# EAGLE design Pressure_pump_V2.1 (EAGLE 9.6.2)
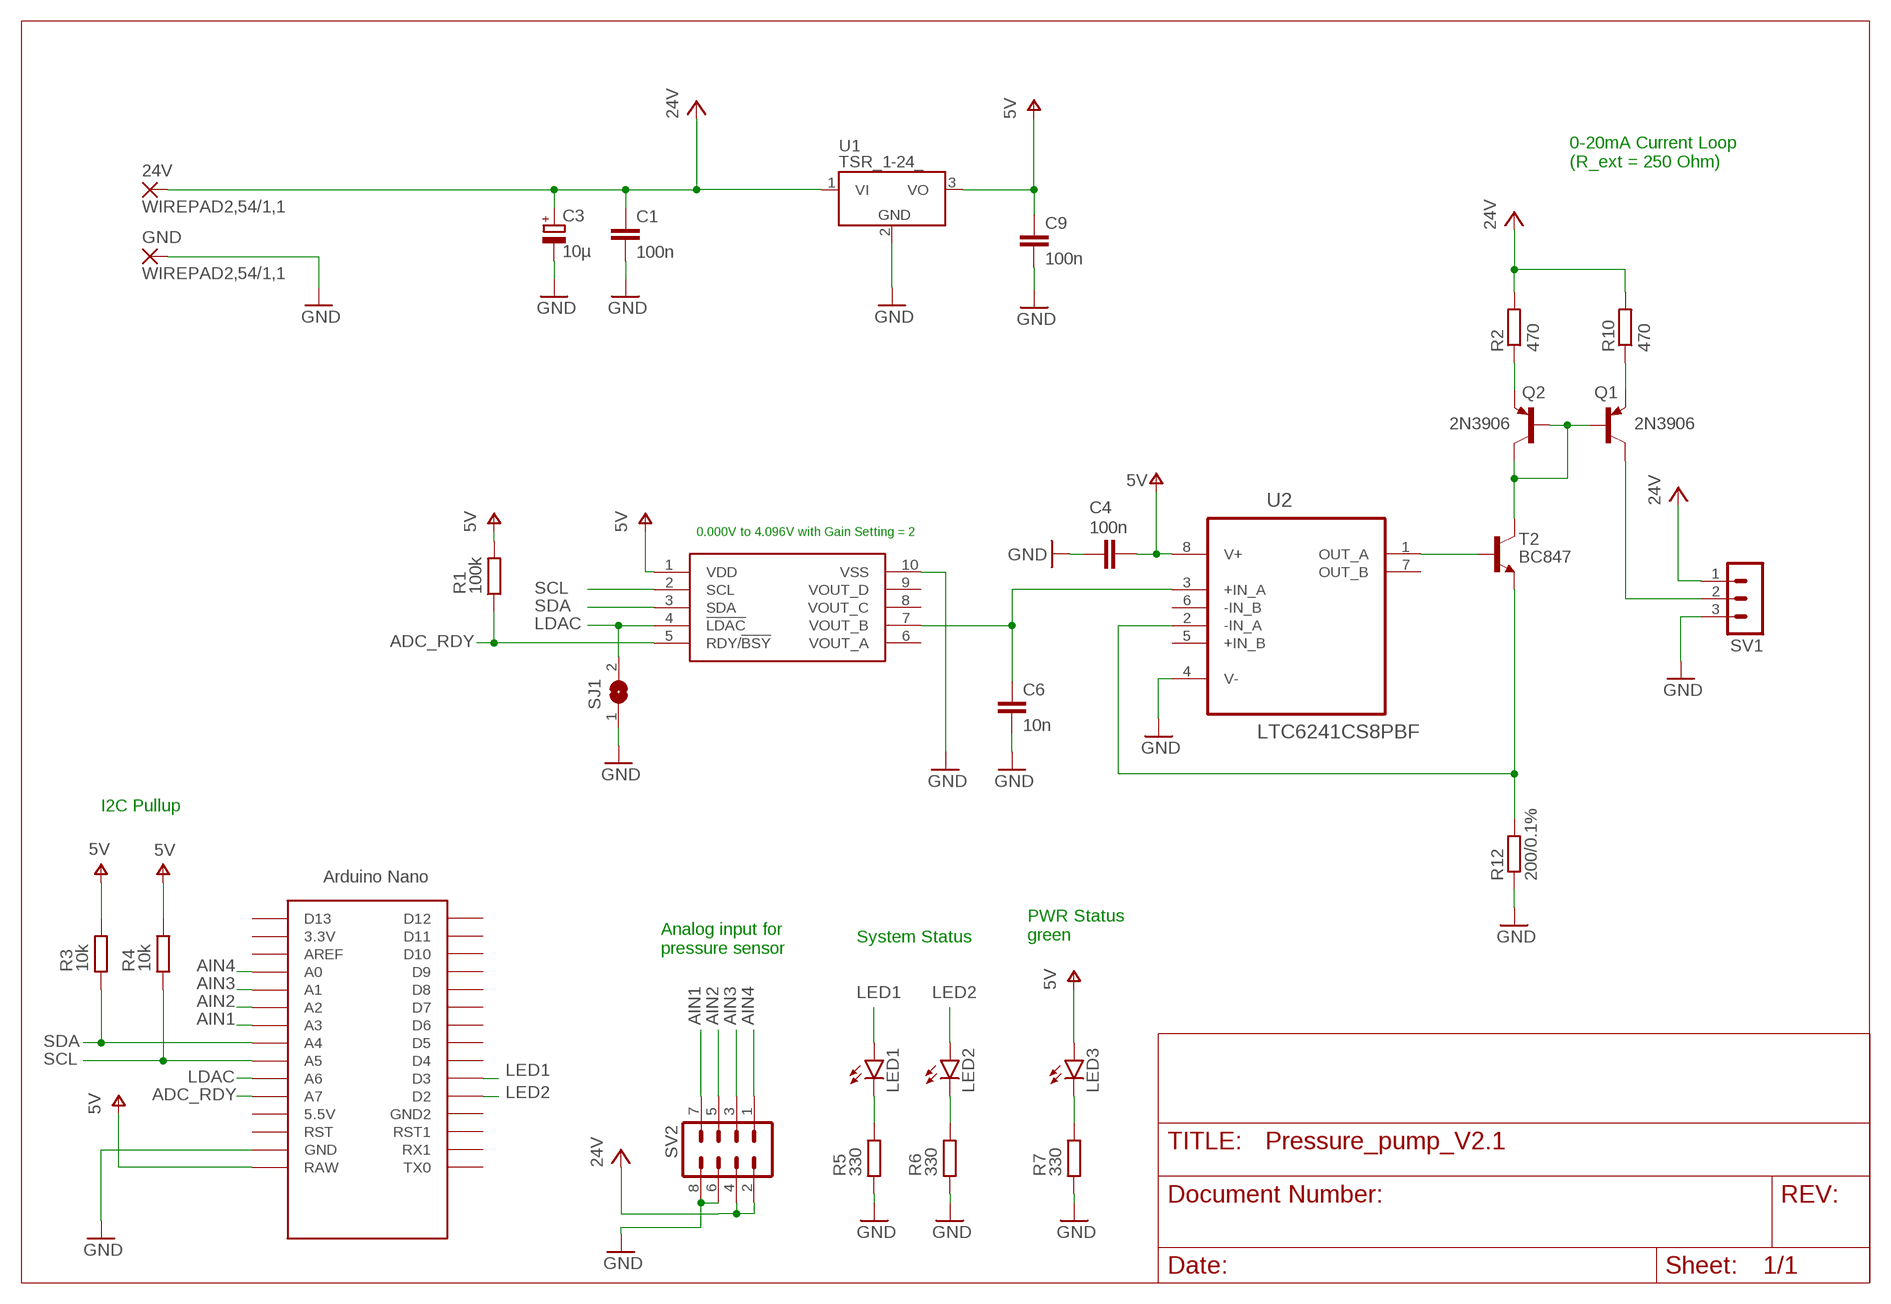
[diagram p0: schematic, sheet 1]

## Parts
24V  WIREPAD2,54/1,1  [2,54/1,1]
C1  100n  C-EUC0603  [C0603]
C3  10µ  CPOL-EU153CLV-0810  [153CLV-0810]
C4  100n  C-EUC0603  [C0603]
C6  10n  C-EUC0603  [C0603]
C9  100n  C-EUC0603  [C0603]
GND  WIREPAD2,54/1,1  [2,54/1,1]
LED1  LED5MM  [LED5MM]
LED2  LED5MM  [LED5MM]
LED3  LED5MM  [LED5MM]
Q1  2N3906  [TO92]
Q2  2N3906  [TO92]
R1  100k  R-EU_R0603  [R0603]
R2  470  R-EU_R0603  [R0603]
R3  10k  R-EU_R0603  [R0603]
R4  10k  R-EU_R0603  [R0603]
R5  330  R-EU_R0603  [R0603]
R6  330  R-EU_R0603  [R0603]
R7  330  R-EU_R0603  [R0603]
R10  470  R-EU_R0603  [R0603]
R12  200/0.1%  R-EU_R0805  [R0805]
SJ1  SJ  [SJ]
SV1  MA03-1  [MA03-1]
SV2  MA04-2  [MA04-2]
T2  BC847  [SOT23]
U1  TSR_1-24_  [TSR-1]
U2  LTC6241CS8PBF  [SOIC127P600X175-8N]
U$1  NANO  [NANO]
U$2  MCP4728  [MSOP10]

## Nets
24V: 24V.1(P) C1.1 C3.+ R2.2 R10.2 SV1.1 SV2.2 SV2.4 U1.1(VI)
ADC_RDY: R1.1 U$1.A7 U$2.5(RDY/!BSY)
AIN1: SV2.7 U$1.A3
AIN2: SV2.5 U$1.A2
AIN3: SV2.3 U$1.A1
AIN4: SV2.1 U$1.A0
GND: C1.2 C3.- C4.1 C6.2 C9.2 GND.1(P) R5.1 R6.1 R7.1 R12.1 SJ1.1 SV1.3 SV2.6 SV2.8 U1.2(GND) U2.4(V-) U$1.GND U$2.10(VSS)
LDAC: SJ1.2 U$1.A6 U$2.4(!LDAC)
LED1: LED1.A U$1.D3
LED2: LED2.A U$1.D2
N$1: Q1.1(C) SV1.2
N$2: Q1.3(E) R10.1
N$3: Q1.2(B) Q2.1(C) Q2.2(B) T2.3(C)
N$4: Q2.3(E) R2.1
N$5: T2.1(B) U2.1(OUT_A)
N$8: LED1.K(C) R5.2
N$9: LED2.K(C) R6.2
N$10: LED3.K(C) R7.2
N$12: C6.1 U2.3(+IN_A) U$2.7(VOUT_B)
N$26: R12.2 T2.2(E) U2.2(-IN_A)
SCL: R4.1 U$1.A5 U$2.2(SCL)
SDA: R3.1 U$1.A4 U$2.3(SDA)
V+: C4.2 C9.1 LED3.A R1.2 R3.2 R4.2 U1.3(VO) U2.8(V+) U$1.RAW U$2.1(VDD) ; supply symbol labelled 5V
Unconnected: U2.5(+IN_B) U2.6(-IN_B) U2.7(OUT_B) U$1.3.3V U$1.5V(5.5V) U$1.AREF U$1.D4 U$1.D5 U$1.D6 U$1.D7 U$1.D8 U$1.D9 U$1.D10 U$1.D11 U$1.D12 U$1.D13 U$1.GND1(GND2) U$1.ICSP1 U$1.ICSP2 U$1.ICSP3 U$1.ICSP4 U$1.ICSP5 U$1.ICSP6 U$1.RST U$1.RST1 U$1.RX1 U$1.TX0 U$2.6(VOUT_A) U$2.8(VOUT_C) U$2.9(VOUT_D)

## Notes on the sheet
- 0-20mA Current Loop
  (R_ext = 250 Ohm)
- 0.000V to 4.096V with Gain Setting = 2
- I2C Pullup
- PWR Status
  green
- System Status
- Analog input for 
  pressure sensor

## Library data of the parts
24V GND = wirepad:WIREPAD: Wire PAD connect wire on PCB
C1 C4 C6 C9 = rcl:C-EU: CAPACITOR, European symbol; SPICEPREFIX: C
C3 = rcl:CPOL-EU: POLARIZED CAPACITOR, European symbol; SPICEPREFIX: C
LED1-LED3 = led:LED: LED OSRAM: - CHIPLED LG R971, LG N971, LY N971, LG Q971, LY Q971, LO R971, LY R971 LH N974, LH R974 LS Q976, LO Q976, LY Q976 LO Q996 - Hyper CHIPLED LW Q18S LB Q993, LB Q99A, LB R99A - SideLED LS A670, LO A670, LY A670, LG A670, LP A670 LB A673, LV A673, LT A673, LW A673 LH A674 LY A675 LS A676, LA A676, LO A676, LY A676, LW A676 LS A679, LY A679, LG A679 - Hyper Micro SIDELED® LS Y876, LA Y876, LO Y876, LY Y876 LT Y87S - SmartLED LW L88C, LW L88S LB L89C, LB L89S, LG L890 LS L89K, LO L89K, LY L89K LS L896, LA L896, LO L896, LY L896 - TOPLED LS T670, LO T670, LY T670, LG T670, LP T670 LSG T670, LSP T670, LSY T670, LOP T670, LYG T670 LG T671, LOG T671, LSG T671 LB T673, LV T673, LT T673, LW T673 LH T674 LS T676, LA T676, LO T676, LY T676, LB T676, LH T676, LSB T676, LW T676 LB T67C, LV T67C, LT T67C, LS T67K, LO T67K, LY T67K, LW E67C LS E67B, LA E67B, LO E67B, LY E67B, LB E67C, LV E67C, LT E67C LW T67C LS T679, LY T679, LG T679 LS T770, LO T770, LY T770, LG T770, LP T770 LB T773, LV T773, LT T773, LW T773 LH T774 LS E675, LA E675, LY E675, LS T675 LS T776, LA T776, LO T776, LY T776, LB T776 LHGB T686 LT T68C, LB T68C - Hyper Mini TOPLED® LB M676 - Mini TOPLED Santana® LG M470 LS M47K, LO M47K, LY M47K Source: http://www.osram.convergy.de LUXEON: - LUMILED® LXK2-PW12-R00, LXK2-PW12-S00, LXK2-PW14-U00, LXK2-PW14-V00 LXK2-PM12-R00, LXK2-PM12-S00, LXK2-PM14-U00 LXK2-PE12-Q00, LXK2-PE12-R00, LXK2-PE12-S00, LXK2-PE14-T00, LXK2-PE14-U00 LXK2-PB12-K00, LXK2-PB12-L00, LXK2-PB12-M00, LXK2-PB14-N00, LXK2-PB14-P00, LXK2-PB14-Q00 LXK2-PR12-L00, LXK2-PR12-M00, LXK2-PR14-Q00, LXK2-PR14-R00 LXK2-PD12-Q00, LXK2-PD12-R00, LXK2-PD12-S00 LXK2-PH12-R00, LXK2-PH12-S00 LXK2-PL12-P00, LXK2-PL12-Q00, LXK2-PL12-R00 Source: www.luxeon.com KINGBRIGHT: KA-3528ASYC Source: www.kingbright.com
Q1 Q2 = transistor-pnp:2N3906: PNP Transistor
R1-R7 R10 R12 = rcl:R-EU_: RESISTOR, European symbol; SPICEPREFIX: R
SJ1 = jumper:SJ: SMD solder JUMPER
SV1 = con-lstb:MA03-1: PIN HEADER; OC_FARNELL: unknown; OC_NEWARK: unknown
SV2 = con-lstb:MA04-2: PIN HEADER; OC_FARNELL: unknown; OC_NEWARK: unknown
T2 = transistor:BC847: NPN TRANSISTOR
U1 = _traco_tsr-1:TSR_1-*: TRACO TSR-1 Series Point-of-Load DC/DC-Converters Vi max. 36 V; Vo = (1.2 .. 15)V ±2%; Io = 0 .. 1 A SIP-Package (drop-in replacement for 78xx linear voltage regulators in TO220-package, vertically assembled) Source: www.tracopower.com Technologies: TSR 1- Vi (V) Vo (V) ±2% Io = 0 .. 1 A 24_ ( generic ) 2412 4.6 .. 36 1.2 2415 4.6 .. 36 1.5 2418 4.6 .. 36 1.8 2425 4.6 .. 36 2.5 2433 4.75.. 36 3.3 2450 6.5 .. 36 5.0 2465 9.0 .. 36 6.5 2490 12 .. 36 9.0 24120 15 .. 36 12 24150 18 .. 36 15 Author: Dipl.-Ing. FH Rainer Bayer HHN Hochschule Heilbronn, rainer.bayer@hs-heilbronn.de Ingenieurbüro ing-rb, mail@ing-rb.de
U2 = LTC_By_element14_Batch_1:LTC6241CS8PBF: Low Noise, Rail-to-Rail Output,CMOS Op Amps; MPN: LTC6241CS8#PBF; OC_FARNELL: 1330969; OC_NEWARK: 56M9989; PACKAGE: SOIC-8; SUPPLIER: Linear Technology
U$1 = Arduino-clone:NANO: Arduino Nano
U$2 = Eagle-Library:MCP4728

## Board
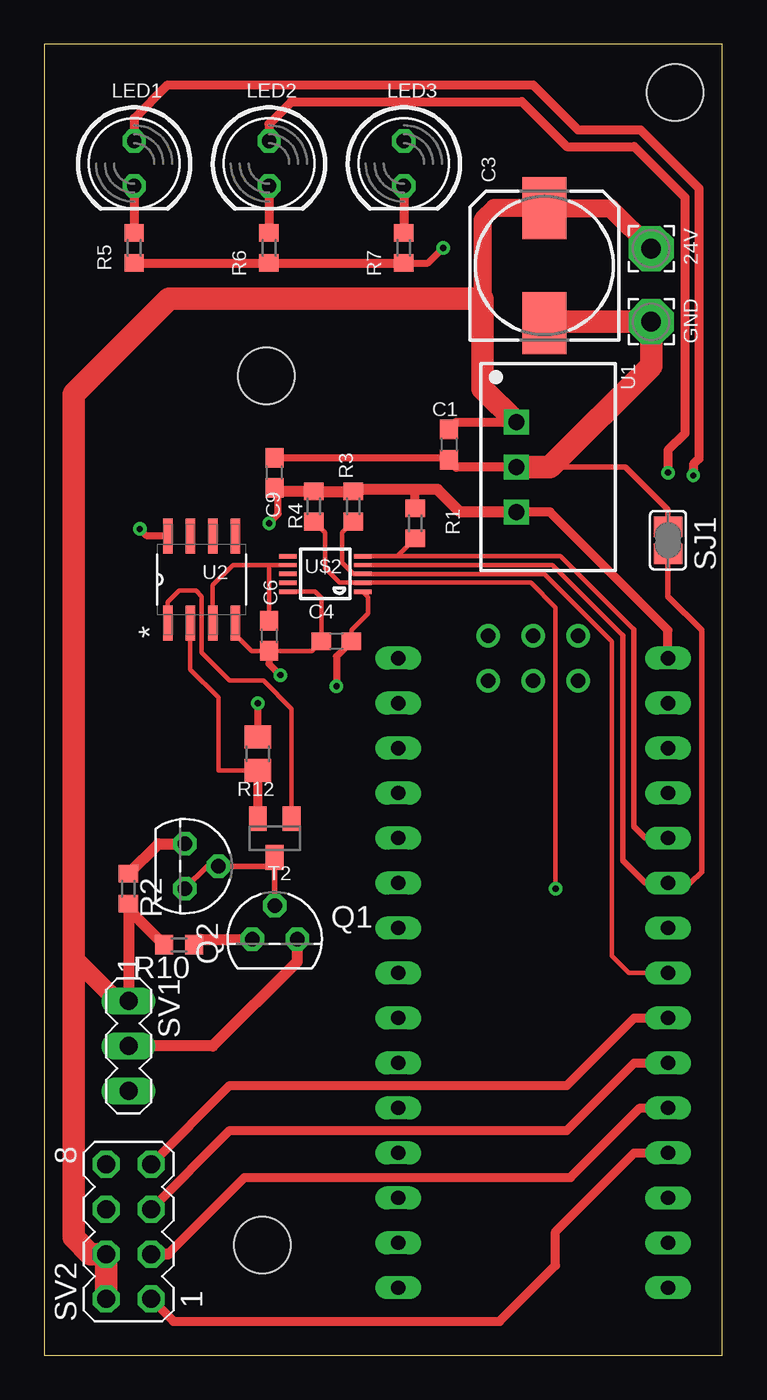
[diagram p1: board, top side]
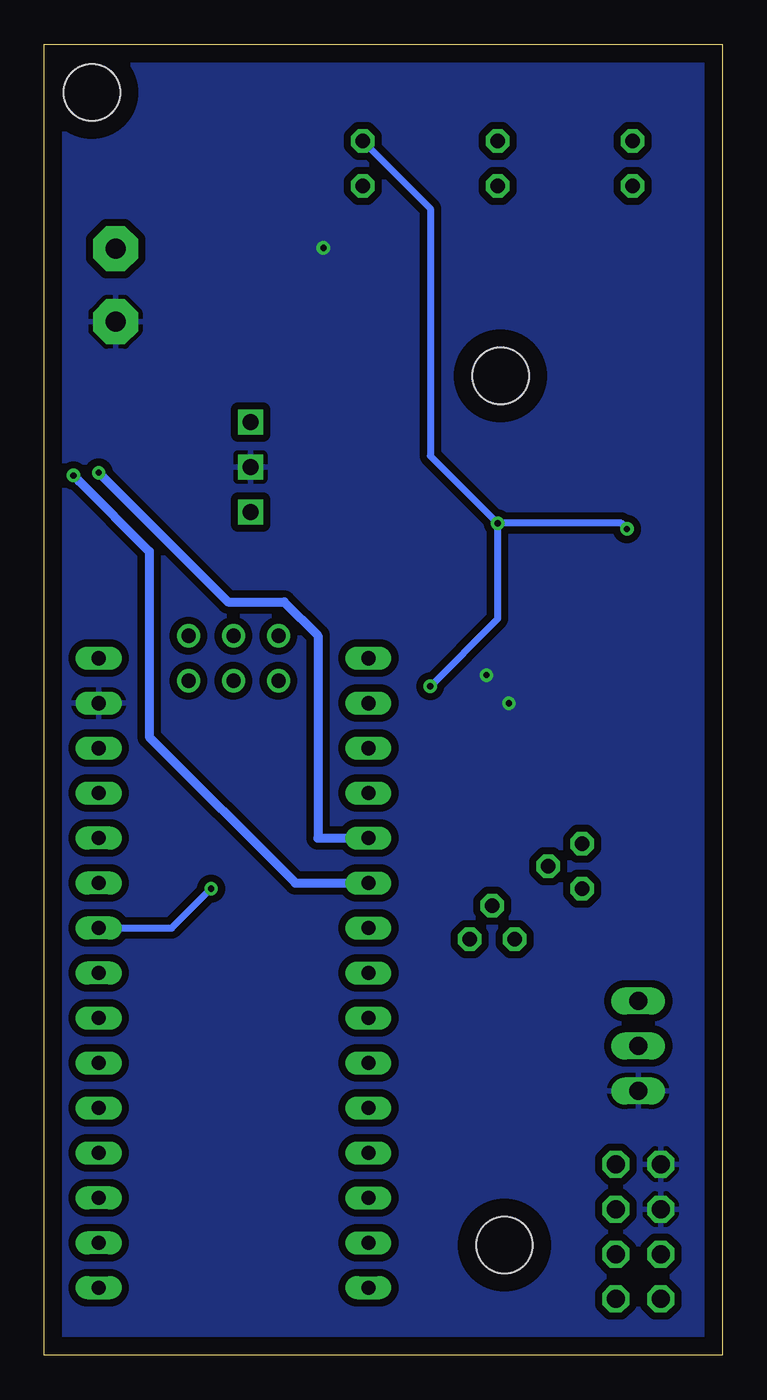
[diagram p2: board, bottom side, seen from below]

Size 38.32 x 74.05 mm. Coordinates in mm from the lower left corner, seen from the top.
Outline: 0,0 38.32,0 38.32,74.05 0,74.05 0,0
Copper layers (1*16): Top 0.035mm / dielectric 1.5mm / Bottom 0.035mm
Design rules "default": minimum track width 6mil, minimum drill 0.35mm, track to track 6mil, track to pad 6mil, pad to pad 6mil, via to via 6mil, smd to smd 6mil, copper to edge 40mil, drill to drill 6mil, minimum pad ring 10mil, minimum via ring 8mil, stop-mask expansion 4mil, vias tented up to drill 0mil, thermal gap 10mil
Holes 3.2 mm at 12.54,55.32 12.32,6.22 35.63,71.32

### Footprints (pad centres in the part's own frame; a part is rotated, then mirrored left to right if it is on the bottom)
2,54/1,1 = drill 1.118 pad 2.54 octagon: 1 0,0
C0603 = smd 1.1 x 1: 1 -0.85,0; 2 0.85,0
153CLV-0810 = smd 3.5 x 2.5: + 3.25,0; - -3.25,0
LED5MM = drill 0.813 octagon: A -1.27,0; K 1.27,0
TO92 = drill 0.813 octagon: 1 1.27,0; 2 0,1.905; 3 -1.27,0
R0603 = smd 1 x 1.1: 1 -0.85,0; 2 0.85,0
R0805 = smd 1.3 x 1.5: 1 -0.95,0; 2 0.95,0
SJ = smd 1.168 x 1.6: 1 -0.762,0; 2 0.762,0
MA03-1 = drill 1.016 long: 1 -2.54,0; 2 0,0; 3 2.54,0
MA04-2 = drill 1.016 octagon: 1 -3.81,-1.27; 2 -3.81,1.27; 3 -1.27,-1.27; 4 -1.27,1.27; 5 1.27,-1.27; 6 1.27,1.27; 7 3.81,-1.27; 8 3.81,1.27
SOT23 = smd 1 x 1.4: 1 -0.95,-1.1; 2 0.95,-1.1; 3 0,1.1
TSR-1 = drill 0.9 square: 1 -2.54,0; 2 0,0; 3 2.54,0
SOIC127P600X175-8N = smd 1.981 x 0.533: 1 -2.464,1.905; 2 -2.464,0.635; 3 -2.464,-0.635; 4 -2.464,-1.905; 5 2.464,-1.905; 6 2.464,-0.635; 7 2.464,0.635; 8 2.464,1.905
NANO = drill 0.8 long: 3.3V -10.16,24.13; 5V -10.16,-1.27; A0 -10.16,19.05; A1 -10.16,16.51; A2 -10.16,13.97; A3 -10.16,11.43; A4 -10.16,8.89; A5 -10.16,6.35; A6 -10.16,3.81; A7 -10.16,1.27; AREF -10.16,21.59; D2 5.08,1.27; D3 5.08,3.81; D4 5.08,6.35; D5 5.08,8.89; D6 5.08,11.43; D7 5.08,13.97; D8 5.08,16.51; D9 5.08,19.05; D10 5.08,21.59; D11 5.08,24.13; D12 5.08,26.67; D13 -10.16,26.67; GND -10.16,-6.35; GND1 5.08,-1.27; RAW -10.16,-8.89; RST -10.16,-3.81; RST1 5.08,-3.81; RX1 5.08,-6.35; TX0 5.08,-8.89 | drill 0.8: ICSP1 -5.08,-10.16; ICSP2 -5.08,-7.62; ICSP3 -2.54,-10.16; ICSP4 -2.54,-7.62; ICSP5 0,-10.16; ICSP6 0,-7.62
MSOP10 = smd 0.25 x 1: 1 -1,-2.113; 2 -0.5,-2.113; 3 0,-2.113; 4 0.5,-2.113; 5 1,-2.113; 6 1,2.113; 7 0.5,2.113; 8 0,2.113; 9 -0.5,2.113; 10 -1,2.113

### Placement (x,y rotation side)
24V  34.29,62.5 0 top
C1  22.86,51.44 270 top
C3  28.26,61.55 90 top
C4  16.51,40.32 0 top
C6  12.7,40.64 270 top
C9  13.02,49.85 90 top
GND  34.29,58.37 0 top
LED1  5.08,67.31 270 top
LED2  12.7,67.31 270 top
LED3  20.32,67.31 270 top
Q1  13.02,23.5 0 top
Q2  7.94,27.62 270 top
R1  20.95,46.99 90 top
R2  4.76,26.35 270 top
R3  17.46,47.94 90 top
R4  15.24,47.94 90 top
R5  5.08,62.55 90 top
R6  12.7,62.55 90 top
R7  20.32,62.55 90 top
R10  7.62,23.18 180 top
R12  12.06,33.97 270 top
SJ1  35.24,46.04 270 top
SV1  4.76,17.46 270 top
SV2  4.76,6.99 90 top
T2  13.02,29.21 180 top
U1  26.67,50.16 270 top
U2  8.89,43.81 90 top
U$1  25.08,30.48 180 top
U$2  15.88,44.13 90 top

### Tracks (layer width: path | path; a pad name or v marks a point on that pad's centre or on a via)
24V
  Top 0.508: C1.1 23.28,52.7 U1.1
  Top 0.61: R2.2 4.76,25.4 | 4.76,25.4 SV1.1 | R10.2 4.76,25.18 4.76,25.4
  Top 1.016: 24.77,59.69 24.77,64.14 25.43,64.8 C3.+ 31.99,64.8 24V.1 | SV1.1 4.13,20 1.65,22.48 1.65,22.61
  Top 1.27: U1.1 24.77,54.61 24.77,59.69 7.05,59.69 1.65,54.29 1.65,22.48 | SV2.2 SV2.4 2.6,5.71 1.65,6.67 1.65,22.61
ADC_RDY
  Top 0.254: U$2.5 18.73,45.13 | R1.1 19.95,45.13 18.73,45.13 | 33.31,40.98 29.16,45.13 18.73,45.13
  Top 0.305: 33.31,40.98 33.31,29.87 33.97,29.21 U$1.A7
AIN1
  Top 0.508: SV2.7 10.48,15.24 29.53,15.24 33.34,19.05 U$1.A3
AIN2
  Top 0.508: SV2.5 10.48,12.7 29.53,12.7 33.34,16.51 U$1.A2
AIN3
  Top 0.508: 6.99,5.71 11.31,10.04 29.73,10.04 33.66,13.97 U$1.A1
  Top 0.61: 6.99,5.71 SV2.3
AIN4
  Top 0.508: U$1.A0 33.34,11.43 28.89,6.99 28.89,5.08 25.72,1.91 7.3,1.91 SV2.1
GND  (via drill 0.35)
  Top 0.254: U2.4 10.79,40.72 11.72,39.79 C6.2 15.13,39.79 C4.1 15.66,42.76 15.29,43.13 U$2.10
  Top 0.305: SJ1.1 35.24,47.75 32.83,50.16 27.3,50.16
  Top 0.406: C9.2 22.75,50.7 C1.2 | v12.06,36.83 R12.1 | 12.7,39.05 C6.2 12.7,39.05 | 12.7,39.05 v13.34,38.42 12.7,39.05 | R7.1 21.69,61.7 v22.54,62.55
  Top 0.508: U1.2 23.28,50.16 C1.2 | R5.1 R6.1 R7.1
  Top 1.016: 28.7,58.69 28.65,58.69 C3.-
  Top 1.27: 28.7,58.69 29.01,58.37 GND.1 34.29,55.88 28.57,50.16 27.3,50.16 U1.2
  pour Bottom (isolate 0.406): 0.32,73.66 38.1,73.66 38.1,0.32 0.32,0.32
LDAC
  Top 0.254: 32.7,40.64 28.71,44.63 U$2.4
  Top 0.305: SJ1.2 35.24,42.86 37.15,40.96 37.15,27.31 36.51,26.67 U$1.A6 33.97,26.67 32.7,27.94 32.7,40.64
LED1  (via drill 0.35)
  Top 0.508: LED1.A 5.08,69.85 6.99,71.75 27.62,71.75 30.16,69.22 33.68,69.22 36.99,65.91 36.99,50.64 36.67,50.32 v36.67,49.69
  Bottom 0.508: v36.67,49.69 36.35,49.37 32.38,45.4 32.38,34.92 24.13,26.67 U$1.D3
LED2  (via drill 0.35)
  Top 0.508: LED2.A 12.7,69.53 13.97,70.8 26.99,70.8 29.53,68.26 33.34,68.26 36.2,65.41 36.2,52.07 35.24,51.12 v35.24,49.85
  Bottom 0.508: v35.24,49.85 27.94,42.55 24.77,42.55 22.86,40.64 22.86,29.21 U$1.D2
N$1
  Top 0.61: Q1.1 14.29,22.23 9.53,17.46 SV1.2
N$2
  Top 0.61: R10.1 8.79,23.5 Q1.3
N$3
  Top 0.305: Q1.2 T2.3 12.53,27.62 Q2.2 9.21,27.62 Q2.1
N$4
  Top 0.61: R2.1 6.45,28.89 Q2.3
N$5
  Top 0.254: U2.1 6.99,42.55 7.62,43.18 8.57,43.18 8.89,42.86 8.89,39.69 10.48,38.1 12.38,38.1 13.97,36.52 T2.1
N$8
  Top 0.508: LED1.K R5.2
N$9
  Top 0.508: LED2.K R6.2
N$10
  Top 0.508: LED3.K R7.2
N$12
  Top 0.254: U$2.7 12.7,44.63 | 12.7,44.63 10.66,44.63 9.53,43.5 U2.3 | C6.1 12.7,44.63
N$26
  Top 0.254: R12.2 9.84,33.02 9.84,37.15 8.26,38.73 U2.2
  Top 0.508: R12.2 T2.2
SCL  (via drill 0.35)
  Top 0.254: U$2.2 18.41,43.63 | 18.41,43.63 16.69,43.63 15.88,44.45 15.88,46.46 R4.1 | 18.41,43.63 20.64,43.63 | 20.64,43.63 20.82,43.63 | v28.89,26.35 28.89,42.23 27.49,43.63 20.64,43.63
  Bottom 0.406: U$1.A5 31.11,24.13 v28.89,26.35
SDA
  Top 0.254: R3.1 16.83,46.46 16.83,44.77 17.46,44.13 U$2.3 28.26,44.13 32.07,40.32 32.07,22.54 33.02,21.59 U$1.A4
V+  (via drill 0.35)
  Top 0.152: 17.57,48.69 R3.2 17.57,48.69
  Top 0.254: U$2.1 18.31,42.81 18.31,41.9 17.36,40.96 C4.2
  Top 0.406: U2.8 5.79,46.28 v5.4,46.67 | v12.7,46.99 13.22,47.51 13.22,48.79 | C4.2 16.51,39.47 v16.51,37.78
  Top 0.508: U1.3 28.57,47.62 35.24,40.96 U$1.RAW | R1.2 20.95,48.9
  Top 0.61: U1.3 23.5,47.62 22.23,48.9 20.95,48.9 17.57,48.9 R3.2 R4.2 13.22,48.79 C9.1
  Bottom 0.406: v5.4,46.67 5.71,46.99 v12.7,46.99 | LED3.A 16.51,64.77 16.51,50.8 v12.7,46.99 | v16.51,37.78 12.7,41.59 v12.7,46.99